# EAGLE schematic single_unit_v_0_1 (EAGLE 5.06)
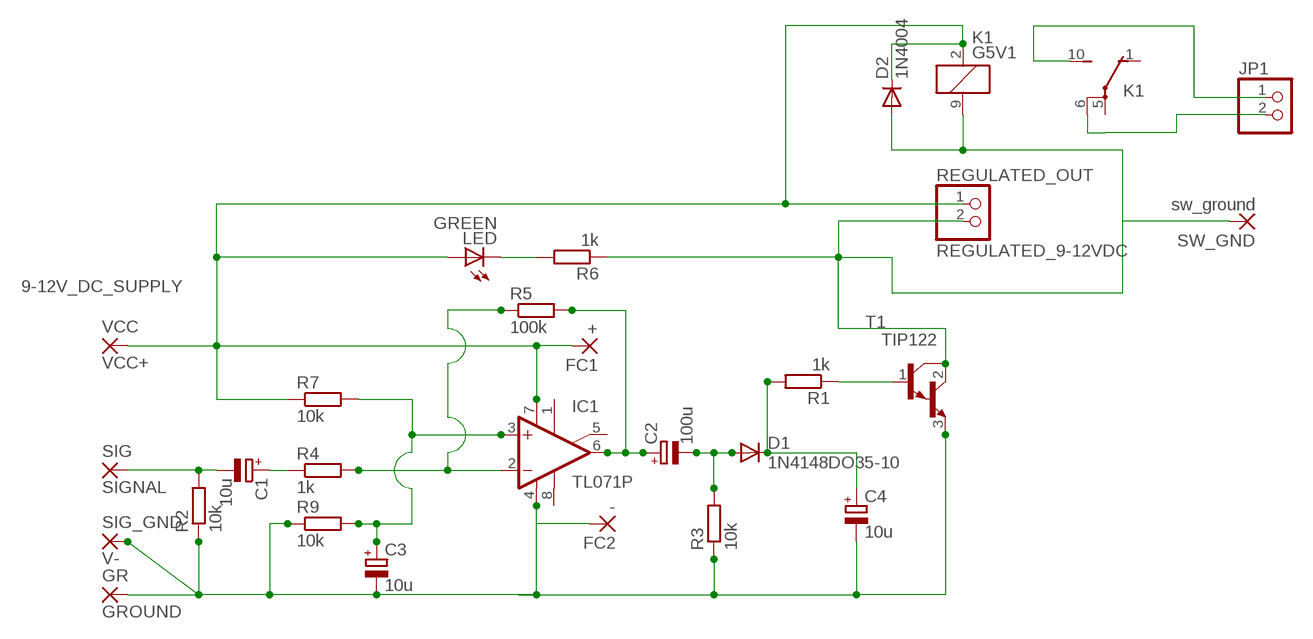
[diagram p0: schematic, sheet 1]

## Parts
C1  10u  CPOL-EUE1.8-4  [E1,8-4]
C2  100u  CPOL-EUE2,5-6E  [E2,5-6E]
C3  10u  CPOL-EUE1.8-4  [E1,8-4]
C4  10u  CPOL-EUE1.8-4  [E1,8-4]
D1  1N4148DO35-10  [DO35-10]
D2  1N4004  [DO41-10]
FC1  +  1,6/0,8  [1,6/0,8]
FC2  -  1,6/0,8  [1,6/0,8]
GR  GROUND  WIREPAD4,16O1,6  [4,16O1,6]
IC1  TL071P  [DIL08]
JP1  PINHD-1X2  [1X02]
K1  G5V1  [G5V1]
LED  GREEN  LED5MM  [LED5MM]
R1  1k  R-EU_0207/7  [0207/7]
R2  10k  R-EU_0207/7  [0207/7]
R3  10k  R-EU_0207/7  [0207/7]
R4  1k  R-EU_0207/7  [0207/7]
R5  100k  R-EU_0207/7  [0207/7]
R6  1k  R-EU_0207/7  [0207/7]
R7  10k  R-EU_0207/7  [0207/7]
R9  10k  R-EU_0207/7  [0207/7]
REGULATED_OUT  REGULATED_9-12VDC  PINHD-1X2  [1X02]
SIG  SIGNAL  WIREPAD2,54/1,0  [2,54/1,0]
SIG_GND  V-  2,54/1,0  [2,54/1,0]
SW_GND  sw_ground  WIREPAD4,16O1,6  [4,16O1,6]
T1  TIP122  [TO220]
VCC  VCC+  WIREPAD4,16O1,6  [4,16O1,6]

## Nets
9-12V_DC_SUPPLY: D2.C FC1.1(P) IC1.7(V+) K1.2 LED.A R7.1 REGULATED_OUT.1 VCC.1(P)
N$1: LED.K(C) R6.2
N$2: C1.- R2.2 SIG.1(P)
N$3: IC1.2(-IN) R4.2 R5.1
N$4: C4.+ D1.C R1.2
N$5: C3.+ IC1.3(+IN) R7.2 R9.2
N$6: C2.+ IC1.6(OUT) R5.2
N$7: C2.- D1.A R3.2
N$8: R1.1 T1.1(B)
N$9: JP1.2 K1.6(2:P)
N$10: C1.+ R4.1
RELAY_OUT: JP1.1 K1.10(2:S)
SWITCHED_GND: D2.A K1.9 R6.1 REGULATED_OUT.2 SW_GND.1(P) T1.2(C)
V-: C3.- C4.- FC2.1(P) GR.1(P) IC1.4(V-) R2.1 R3.1 R9.1 SIG_GND.1(P) T1.3(E)
Unconnected: IC1.1(ON1) IC1.5(ON2) IC1.8(OPT) K1.1(2:O) K1.5(2:P)

## Library data of the parts
C1-C4 = resistor:CPOL-EU: POLARIZED CAPACITOR, European symbol
D1 = diode:1N4148: DIODE high speed (Philips)
D2 = diode:1N4004: DIODE general purpose rectifier, 1 A
FC1 FC2 = wirepad:1,6/0,8: THROUGH-HOLE PAD
GR SIG SW_GND VCC = wirepad:WIREPAD: Wire PAD connect wire on PCB
IC1 = linear:TL071: OP AMP
JP1 REGULATED_OUT = pinhead:PINHD-1X2: PIN HEADER
K1 = relay:G5V1: RELAY 1 x switch, 0.5 A/125 V AC, 1 A/24 V DC , Omron
LED = led:LED: LED OSRAM: - CHIPLED LG R971, LG N971, LY N971, LG Q971, LY Q971, LO R971, LY R971 LH N974, LH R974 LS Q976, LO Q976, LY Q976 LO Q996 - Hyper CHIPLED LW Q18S LB Q993, LB Q99A, LB R99A - SideLED LS A670, LO A670, LY A670, LG A670, LP A670 LB A673, LV A673, LT A673, LW A673 LH A674 LY A675 LS A676, LA A676, LO A676, LY A676, LW A676 LS A679, LY A679, LG A679 - Hyper Micro SIDELED® LS Y876, LA Y876, LO Y876, LY Y876 LT Y87S - SmartLED LW L88C, LW L88S LB L89C, LB L89S, LG L890 LS L89K, LO L89K, LY L89K LS L896, LA L896, LO L896, LY L896 - TOPLED LS T670, LO T670, LY T670, LG T670, LP T670 LSG T670, LSP T670, LSY T670, LOP T670, LYG T670 LG T671, LOG T671, LSG T671 LB T673, LV T673, LT T673, LW T673 LH T674 LS T676, LA T676, LO T676, LY T676, LB T676, LH T676, LSB T676, LW T676 LB T67C, LV T67C, LT T67C, LS T67K, LO T67K, LY T67K, LW E67C LS E67B, LA E67B, LO E67B, LY E67B, LB E67C, LV E67C, LT E67C LW T67C LS T679, LY T679, LG T679 LS T770, LO T770, LY T770, LG T770, LP T770 LB T773, LV T773, LT T773, LW T773 LH T774 LS E675, LA E675, LY E675, LS T675 LS T776, LA T776, LO T776, LY T776, LB T776 LHGB T686 LT T68C, LB T68C - Hyper Mini TOPLED® LB M676 - Mini TOPLED Santana® LG M470 LS M47K, LO M47K, LY M47K Source: http://www.osram.convergy.de LUXEON: - LUMILED® LXK2-PW12-R00, LXK2-PW12-S00, LXK2-PW14-U00, LXK2-PW14-V00 LXK2-PM12-R00, LXK2-PM12-S00, LXK2-PM14-U00 LXK2-PE12-Q00, LXK2-PE12-R00, LXK2-PE12-S00, LXK2-PE14-T00, LXK2-PE14-U00 LXK2-PB12-K00, LXK2-PB12-L00, LXK2-PB12-M00, LXK2-PB14-N00, LXK2-PB14-P00, LXK2-PB14-Q00 LXK2-PR12-L00, LXK2-PR12-M00, LXK2-PR14-Q00, LXK2-PR14-R00 LXK2-PD12-Q00, LXK2-PD12-R00, LXK2-PD12-S00 LXK2-PH12-R00, LXK2-PH12-S00 LXK2-PL12-P00, LXK2-PL12-Q00, LXK2-PL12-R00 Source: www.luxeon.com KINGBRIGHT: KA-3528ASYC Source: www.kingbright.com
R1-R7 = rcl:R-EU_: RESISTOR, European symbol
R9 = resistor:R-EU_: RESISTOR, European symbol
SIG_GND = wirepad:2,54/1,0: THROUGH-HOLE PAD
T1 = transistor:TIP122: NPN BIPOLAR DARLINGTON TRANSISTOR